# Altium schematic sheet 04 - AUDIO.SchDoc
size A4
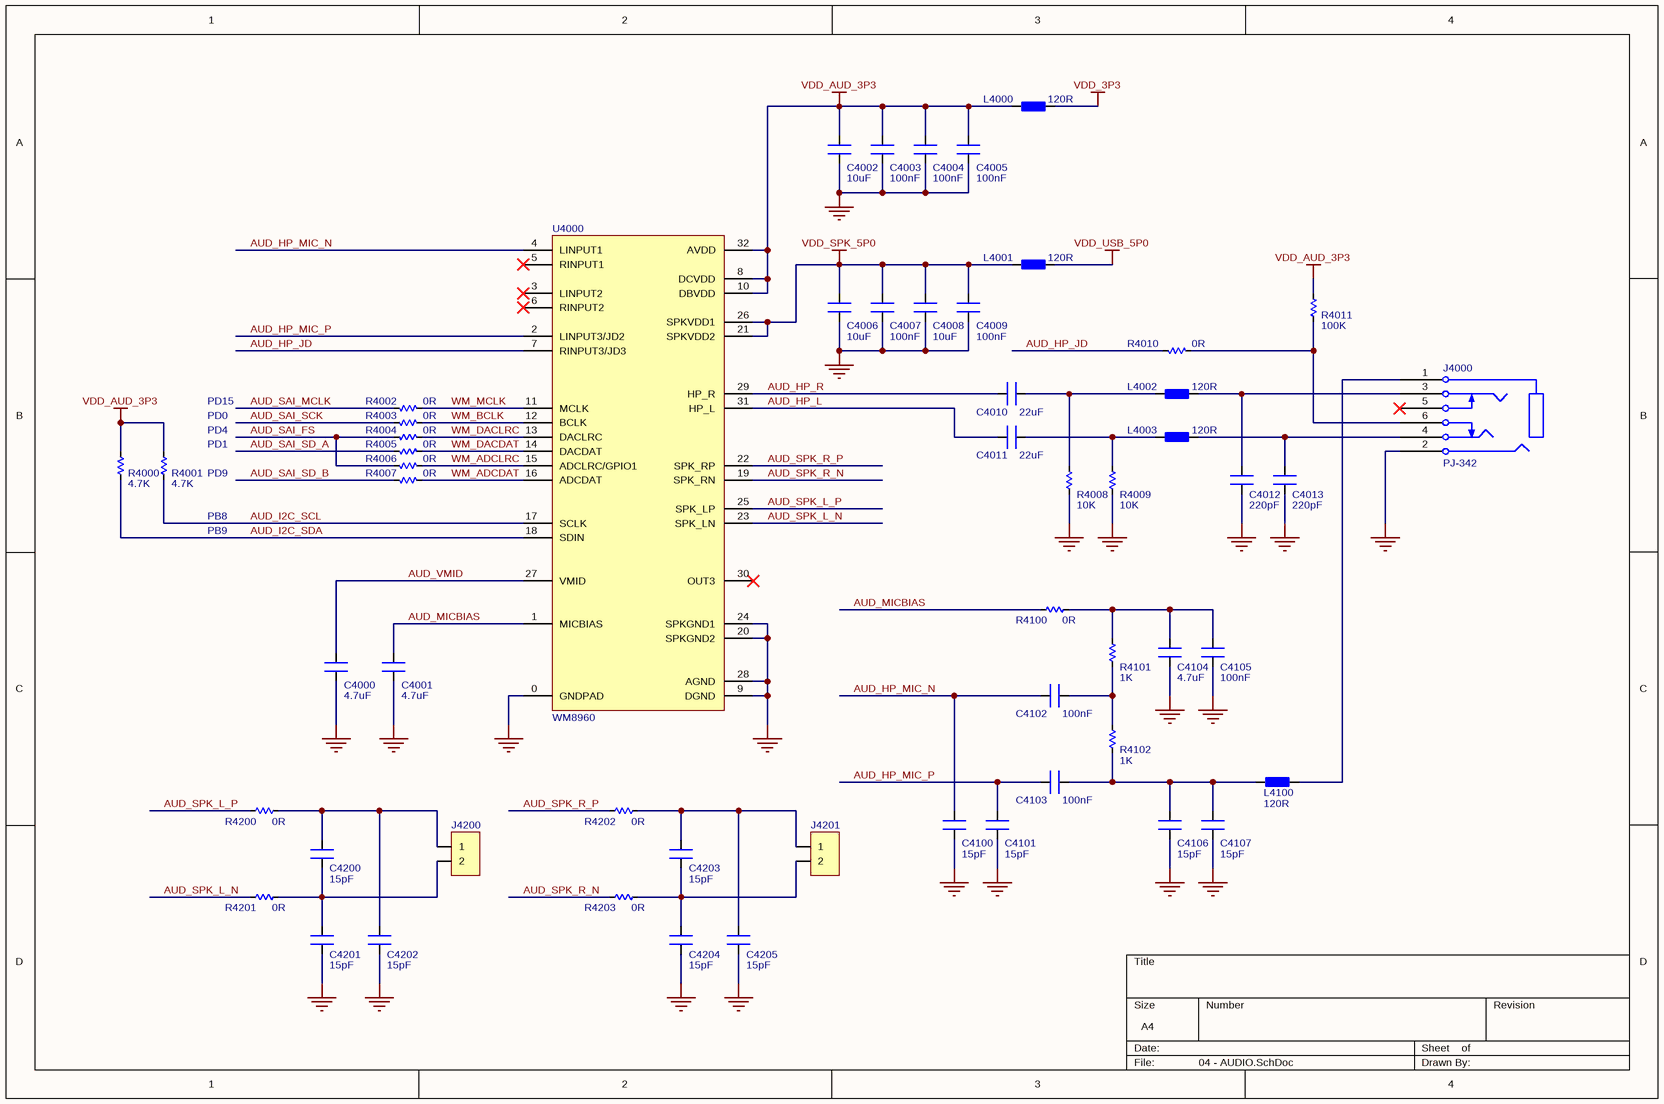
[diagram p0: 04 - AUDIO.SchDoc]

## Parts
C4000  value 4.7uF  [CN-SMD-0402]  (hidden comment: Capacitor)
C4001  value 4.7uF  [CN-SMD-0402]  (hidden comment: Capacitor)
C4002  value 10uF  [CN-SMD-0603]  (hidden comment: Capacitor)
C4003  value 100nF  [CN-SMD-0402]  (hidden comment: Capacitor)
C4004  value 100nF  [CN-SMD-0402]  (hidden comment: Capacitor)
C4005  value 100nF  [CN-SMD-0402]  (hidden comment: Capacitor)
C4006  value 10uF  [CN-SMD-0603]  (hidden comment: Capacitor)
C4007  value 100nF  [CN-SMD-0603]  (hidden comment: Capacitor)
C4008  value 10uF  [CN-SMD-0603]  (hidden comment: Capacitor)
C4009  value 100nF  [CN-SMD-0603]  (hidden comment: Capacitor)
C4010  value 22uF  [CN-SMD-0603]  (hidden comment: Capacitor)
C4011  value 22uF  [CN-SMD-0603]  (hidden comment: Capacitor)
C4012  value 220pF  [CN-SMD-0402]  (hidden comment: Capacitor)
C4013  value 220pF  [CN-SMD-0402]  (hidden comment: Capacitor)
C4100  value 15pF  [CN-SMD-0402]  (hidden comment: Capacitor)
C4101  value 15pF  [CN-SMD-0402]  (hidden comment: Capacitor)
C4102  value 100nF  [CN-SMD-0402]  (hidden comment: Capacitor)
C4103  value 100nF  [CN-SMD-0402]  (hidden comment: Capacitor)
C4104  value 4.7uF  [CN-SMD-0402]  (hidden comment: Capacitor)
C4105  value 100nF  [CN-SMD-0402]  (hidden comment: Capacitor)
C4106  value 15pF  [CN-SMD-0402]  (hidden comment: Capacitor)
C4107  value 15pF  [CN-SMD-0402]  (hidden comment: Capacitor)
C4200  value 15pF  [CN-SMD-0402]  (hidden comment: Capacitor)
C4201  value 15pF  [CN-SMD-0402]  (hidden comment: Capacitor)
C4202  value 15pF  [CN-SMD-0402]  (hidden comment: Capacitor)
C4203  value 15pF  [CN-SMD-0402]  (hidden comment: Capacitor)
C4204  value 15pF  [CN-SMD-0402]  (hidden comment: Capacitor)
C4205  value 15pF  [CN-SMD-0402]  (hidden comment: Capacitor)
J4000  PJ-342  [AUDIO_PJ-342]
J4200  JP2  [JP2-D1T]  (value not drawn)
J4201  JP2  [JP2-D1T]  (value not drawn)
L4000  value 120R  [L-SMD-0402]  (hidden comment: Ferrite bead)
L4001  value 120R  [L-SMD-0603]  (hidden comment: Ferrite bead)
L4002  value 120R  [L-SMD-0402]  (hidden comment: Ferrite bead)
L4003  value 120R  [L-SMD-0402]  (hidden comment: Ferrite bead)
L4100  value 120R  [L-SMD-0402]  (hidden comment: Ferrite bead)
R4000  value 4.7K  [RES-SMD-0402]  (hidden comment: Resistor)
R4001  value 4.7K  [RES-SMD-0402]  (hidden comment: Resistor)
R4002  value 0R  [RES-SMD-0402]  (hidden comment: Resistor)
R4003  value 0R  [RES-SMD-0402]  (hidden comment: Resistor)
R4004  value 0R  [RES-SMD-0402]  (hidden comment: Resistor)
R4005  value 0R  [RES-SMD-0402]  (hidden comment: Resistor)
R4006  value 0R  [RES-SMD-0402]  (hidden comment: Resistor)
R4007  value 0R  [RES-SMD-0402]  (hidden comment: Resistor)
R4008  value 10K  [RES-SMD-0402]  (hidden comment: Resistor)
R4009  value 10K  [RES-SMD-0402]  (hidden comment: Resistor)
R4010  value 0R  [RES-SMD-0402]  (hidden comment: Resistor)
R4011  value 100K  [RES-SMD-0402]  (hidden comment: Resistor)
R4100  value 0R  [RES-SMD-0402]  (hidden comment: Resistor)
R4101  value 1K  [RES-SMD-0402]  (hidden comment: Resistor)
R4102  value 1K  [RES-SMD-0402]  (hidden comment: Resistor)
R4200  value 0R  [RES-SMD-0402]  (hidden comment: Resistor)
R4201  value 0R  [RES-SMD-0402]  (hidden comment: Resistor)
R4202  value 0R  [RES-SMD-0402]  (hidden comment: Resistor)
R4203  value 0R  [RES-SMD-0402]  (hidden comment: Resistor)
U4000  WM8960  [QFN50P500X500X100-33N-D]

## Nets
GND: C4000.1 C4001.1 C4002.1 C4003.1 C4004.1 C4005.1 C4006.1 C4007.1 C4008.1 C4009.1 C4012.1 C4013.1 C4100.1 C4101.1 C4104.1 C4105.1 C4106.1 C4107.1 C4201.1 C4202.1 C4204.1 C4205.1 J4000.2(GND) R4008.2 R4009.2 U4000.0(GNDPAD) U4000.9(DGND) U4000.20(SPKGND2) U4000.24(SPKGND1) U4000.28(AGND)
VDD_3P3: L4000.1
VDD_AUD_3P3: C4002.2 C4003.2 C4004.2 C4005.2 L4000.2 R4000.1 R4001.1 R4011.1 U4000.8(DCVDD) U4000.10(DBVDD) U4000.32(AVDD)
VDD_SPK_5P0: C4006.2 C4007.2 C4008.2 C4009.2 L4001.2 U4000.21(SPKVDD2) U4000.26(SPKVDD1)
VDD_USB_5P0: L4001.1
AUD_HP_JD: R4010.2 U4000.7(RINPUT3/JD3)
AUD_HP_L: C4011.2 U4000.31(HP_L)
AUD_HP_MIC_N: C4100.2 C4102.2 U4000.4(LINPUT1)
AUD_HP_MIC_P: C4101.2 C4103.2 U4000.2(LINPUT3/JD2)
AUD_HP_R: C4010.2 U4000.29(HP_R)
AUD_I2C_SCL: R4001.2 U4000.17(SCLK)
AUD_I2C_SDA: R4000.2 U4000.18(SDIN)
AUD_MICBIAS: C4001.2 R4100.1 U4000.1(MICBIAS)
AUD_SAI_FS: R4004.2 R4006.2
AUD_SAI_MCLK: R4002.2
AUD_SAI_SCK: R4003.2
AUD_SAI_SD_A: R4005.2
AUD_SAI_SD_B: R4007.2
AUD_SPK_L_N: R4201.1 U4000.23(SPK_LN)
AUD_SPK_L_P: R4200.1 U4000.25(SPK_LP)
AUD_SPK_R_N: R4203.1 U4000.19(SPK_RN)
AUD_SPK_R_P: R4202.1 U4000.22(SPK_RP)
AUD_VMID: C4000.2 U4000.27(VMID)
WM_ADCDAT: R4007.1 U4000.16(ADCDAT)
WM_ADCLRC: R4006.1 U4000.15(ADCLRC/GPIO1)
WM_BCLK: R4003.1 U4000.12(BCLK)
WM_DACDAT: R4005.1 U4000.14(DACDAT)
WM_DACLRC: R4004.1 U4000.13(DACLRC)
WM_MCLK: R4002.1 U4000.11(MCLK)
NetC4010_1: C4010.1 L4002.2 R4008.1
NetC4011_1: C4011.1 L4003.2 R4009.1
NetC4012_2: C4012.2 J4000.3(RIGHT) L4002.1
NetC4013_2: C4013.2 J4000.4(LEFT) L4003.1
NetC4102_1: C4102.1 R4101.2 R4102.1
NetC4103_1: C4103.1 C4106.2 C4107.2 L4100.2 R4102.2
NetC4104_2: C4104.2 C4105.2 R4100.2 R4101.1
NetC4200_1: C4200.1 C4201.2 J4200.2 R4201.2
NetC4200_2: C4200.2 C4202.2 J4200.1 R4200.2
NetC4203_1: C4203.1 C4204.2 J4201.2 R4203.2
NetC4203_2: C4203.2 C4205.2 J4201.1 R4202.2
NetJ4000_1: J4000.1(MIC) L4100.1
NetJ4000_6: J4000.6 R4010.1 R4011.2

Not connected (* = marked no-connect by the designer): J4000 5*; U4000 3(LINPUT2)* 5(RINPUT1)* 6(RINPUT2)* 30(OUT3)*

## Notes on the sheet
- PD15
- (near R4001) PD1
- (near R4001) PD4
- (near R4001) PD0
- (near R4001) PD9
- (near R4001) PB8
- PB9

## Library data of the parts
C4000 C4001 C4104 = Cap: Ceramic Capacitor SMD 0402 4.7uF ±20% 10V
C4002 C4006 C4008 = Cap: Ceramic Capacitor SMD 0603 10uF ±20% 10V
C4003-C4005 C4102 C4103 C4105 = Cap: Ceramic Capacitor SMD 0402 100nF ±20% 16V
C4007 C4009 = Cap: Ceramic Capacitor SMD 0603 100nF ±20% 50V
C4010 C4011 = Cap: Ceramic Capacitor SMD 0603 22uF ±20% 6.3V
C4012 C4013 = Cap: Ceramic Capacitor SMD 0402 220pF ±20% 50V
C4100 C4101 C4106 C4107 C4200-C4205 = Cap: Ceramic Capacitor SMD 0402 15pF ±20% 50V
J4000 = PJ-342: Audio connector PJ-342 3.5mm 4-pole; Connector type: AUDIO BLACK HEADER; Category: Connector; Status: Production
J4200 J4201 = JP2: Single 2-pin jumper
L4000 L4002 L4003 L4100 = Ferrite bead: Ferrite bead SMD 0402 120 Ohm @100MHz
L4001 = Ferrite bead: Ferrite bead SMD 0603 120 Ohm @100MHz
R4000 R4001 = Res: Resistor SMD 0402 4.7K 1% 0.063W
R4002-R4007 R4010 R4100 R4200-R4203 = Res: Resistor SMD 0402 0R 1% 0.063W
R4008 R4009 = Res: Resistor SMD 0402 10K 1% 0.063W
R4011 = Res: Resistor SMD 0402 100K 1% 0.063W
R4101 R4102 = Res: Resistor SMD 0402 1K 1% 0.063W
U4000 = WM8960: Cirrus Logic Stereo CODEC with 1W Stereo Class-D Speaker Drivers and Headphone Drivers for Portable Audio Applications